# Altium schematic sheet [04] - MECHANICAL.SchDoc
size A3; DocumentNumber: 4; SheetNumber: 4; SheetTotal: 6
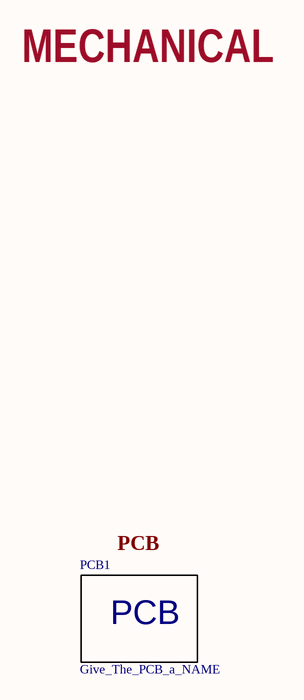
[diagram p0: [04] - MECHANICAL.SchDoc]

## Parts
PCB1  Give_The_PCB_a_NAME

## Notes on the sheet
- MECHANICAL
- PCB
- Project:
- Revision:
- Engineer:
- Title:
- Pag
- of
- Date:
- Hour:
- Variant:
- Embedded Things

## Library data of the parts
PCB1 = PCB: Printed Circuit Board; Category: Printed Circuit Board